# EAGLE design expansion_module_BLE_BMD330AR (EAGLE 9.6.2)
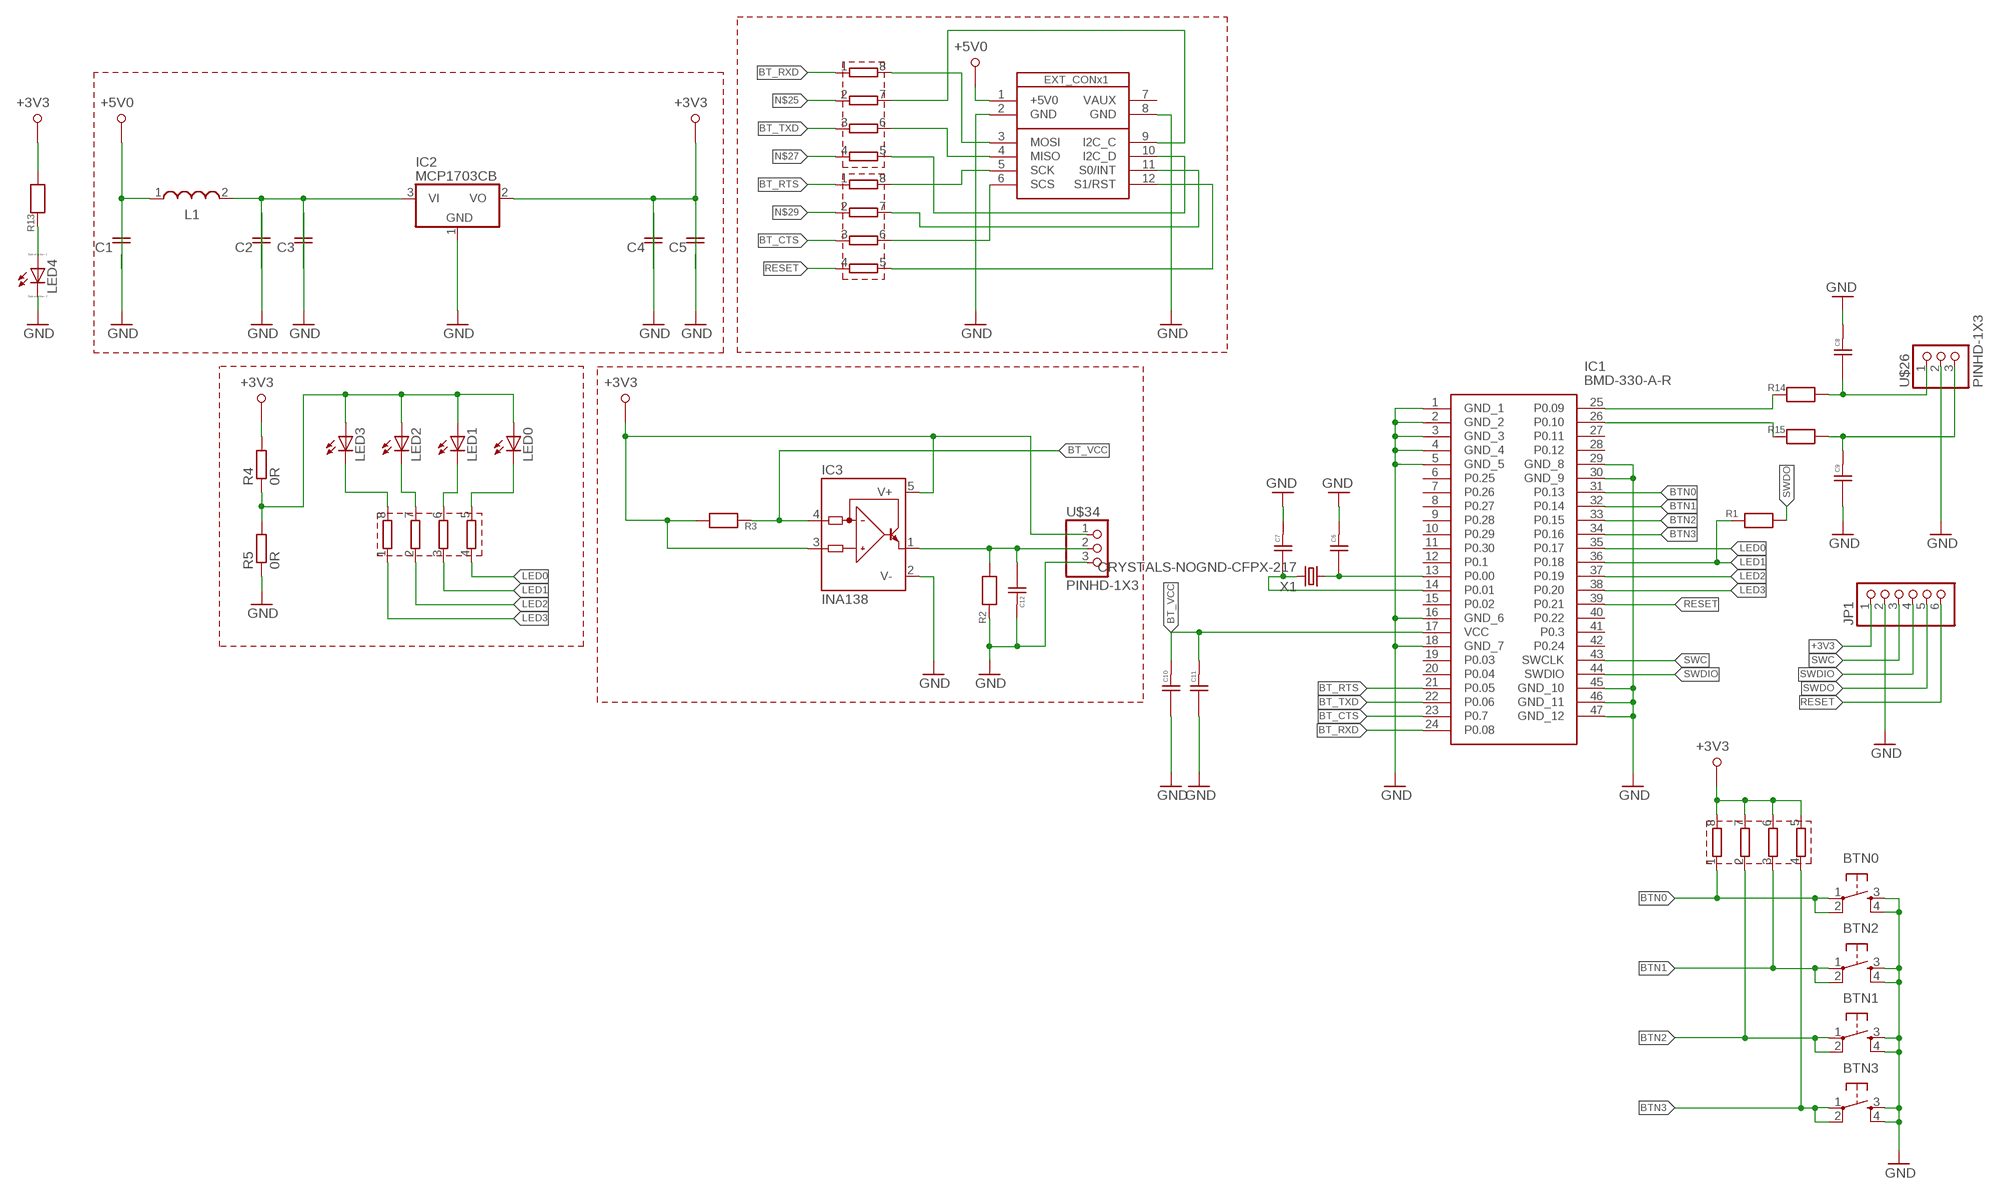
[diagram p0: schematic, sheet 1]

## Parts
BTN0  TACT-SWITCH-SMD_KMR2  [KMR2]
BTN1  TACT-SWITCH-SMD_KMR2  [KMR2]
BTN2  TACT-SWITCH-SMD_KMR2  [KMR2]
BTN3  TACT-SWITCH-SMD_KMR2  [KMR2]
C1  CAPACITOR_CERAMIC_0402  [CAPACITOR_0402]
C2  CAPACITOR_CERAMIC_0402  [CAPACITOR_0402]
C3  CAPACITOR_CERAMIC_0402  [CAPACITOR_0402]
C4  CAPACITOR_CERAMIC_0402  [CAPACITOR_0402]
C5  CAPACITOR_CERAMIC_0402  [CAPACITOR_0402]
C6  CAPACITOR_CERAMIC_0402  [CAPACITOR_0402]
C7  CAPACITOR_CERAMIC_0402  [CAPACITOR_0402]
C8  CAPACITOR_CERAMIC_0402  [CAPACITOR_0402]
C9  CAPACITOR_CERAMIC_0402  [CAPACITOR_0402]
C10  CAPACITOR_CERAMIC_0402  [CAPACITOR_0402]
C11  CAPACITOR_CERAMIC_0402  [CAPACITOR_0402]
C12  CAPACITOR_CERAMIC_0402  [CAPACITOR_0402]
IC1  BMD-330-A-R  [BMD-300]
IC2  MCP1703CB  [SOT23]
IC3  INA138  [SOT23-5]
JP1  PINHD-1X6  [1X06]
L1  WE-LQ_1210  [WE-LQ_M]
LED0  LEDSML0603  [SML0603]
LED1  LEDSML0603  [SML0603]
LED2  LEDSML0603  [SML0603]
LED3  LEDSML0603  [SML0603]
LED4  LED_ESML0603  [LED_SML0603]
R1  RESISTOR_0402  [RESISITOR_0402]
R2  RESISTOR_0402  [RESISITOR_0402]
R3  RESISTOR_0402  [RESISITOR_0402]
R4  0R  R-EU_R0603  [R0603]
R5  0R  R-EU_R0603  [R0603]
R13  RESISTOR_0402  [RESISITOR_0402]
R14  RESISTOR_0402  [RESISITOR_0402]
R15  RESISTOR_0402  [RESISITOR_0402]
RN1  RESISTOR-DIL_4R-N  [EXB28V]
RN2  RESISTOR-DIL_4R-N  [EXB28V]
RN3  RESISTOR-DIL_4R-N  [EXB28V]
RN4  RESISTOR-DIL_4R-N  [EXB28V]
U$1  SB_EXT_CON_X1_SPI  [SB_EXT_CON_X1_FULL]
U$26  PINHD-1X3  [1X03]
U$34  PINHD-1X3  [1X03]
X1  CRYSTALS-NOGND-CFPX-217  [3.2X1.5-2-PAD]

## Nets
+3V3: C4.2 C5.2 IC2.2(VO) IC3.3(IN+) IC3.5(V+) JP1.1 R3.2 R4.2 R13.2 RN4.5 RN4.6 RN4.7 RN4.8 U$34.1
+5V0: C1.2 L1.1 U$1.1(+5V0)
BT_CTS: IC1.23(P0.7) RN1.3
BT_RTS: IC1.21(P0.05) RN1.1
BT_RXD: IC1.24(P0.08) RN2.1
BT_TXD: IC1.22(P0.06) RN2.3
BT_VCC: C10.2 C11.2 IC1.17(VCC) IC3.4(IN-) R3.1
BTN0: BTN0.1 BTN0.2 IC1.31(P0.13) RN4.1
BTN1: BTN2.1 BTN2.2 IC1.32(P0.14) RN4.3
BTN2: BTN1.1 BTN1.2 IC1.33(P0.15) RN4.2
BTN3: BTN3.1 BTN3.2 IC1.34(P0.16) RN4.4
GND: BTN0.3 BTN0.4 BTN1.3 BTN1.4 BTN2.3 BTN2.4 BTN3.3 BTN3.4 C1.1 C2.1 C3.1 C4.1 C5.1 C6.2 C7.2 C8.2 C9.1 C10.1 C11.1 C12.2 IC1.1(GND_1) IC1.2(GND_2) IC1.3(GND_3) IC1.4(GND_4) IC1.5(GND_5) IC1.16(GND_6) IC1.18(GND_7) IC1.29(GND_8) IC1.30(GND_9) IC1.45(GND_10) IC1.46(GND_11) IC1.47(GND_12) IC2.1(GND) IC3.2(V-) JP1.2 LED4.C R2.1 R5.1 U$1.2(GND) U$1.8(GND) U$26.2 U$34.3
LED0: IC1.35(P0.17) RN3.4
LED1: IC1.36(P0.18) R1.1 RN3.3
LED2: IC1.37(P0.19) RN3.2
LED3: IC1.38(P0.20) RN3.1
N$1: C2.2 C3.2 IC2.3(VI) L1.2
N$6: LED2.C RN3.7
N$7: LED1.C RN3.6
N$8: RN2.6 U$1.4(MISO)
N$9: LED0.A LED1.A LED2.A LED3.A R4.1 R5.2
N$10: LED0.C RN3.5
N$11: LED4.A R13.1
N$12: RN2.8 U$1.3(MOSI)
N$13: RN1.8 U$1.5(SCK)
N$14: RN1.6 U$1.6(SCS)
N$15: RN2.7 U$1.9(I2C_C)
N$16: C12.1 IC3.1(OUT) R2.2 U$34.2
N$17: IC1.25(P0.09) R14.1
N$18: IC1.26(P0.10) R15.1
N$19: C9.2 R15.2 U$26.3
N$20: C8.1 R14.2 U$26.1
N$21: RN2.5 U$1.10(I2C_D)
N$22: RN1.7 U$1.11(S0/INT)
N$23: RN1.5 U$1.12(S1/RST)
N$24: LED3.C RN3.8
N$25: RN2.2
N$26: C6.1 IC1.13(P0.00) X1.1
N$27: RN2.4
N$28: C7.1 IC1.14(P0.01) X1.2
N$29: RN1.2
RESET: IC1.39(P0.21) JP1.6 RN1.4
SWC: IC1.43(SWCLK) JP1.3
SWDIO: IC1.44(SWDIO) JP1.4
SWDO: JP1.5 R1.2
Unconnected: IC1.6(P0.25) IC1.7(P0.26) IC1.8(P0.27) IC1.9(P0.28) IC1.10(P0.29) IC1.11(P0.30) IC1.12(P0.1) IC1.15(P0.02) IC1.19(P0.03) IC1.20(P0.04) IC1.27(P0.11) IC1.28(P0.12) IC1.40(P0.22) IC1.41(P0.3) IC1.42(P0.24) U$1.7(VAUX)

## Library data of the parts
BTN0 BTN1-BTN3 = FaBo-Switch:TACT-SWITCH: Part No Maker Datasheet Distributor 1273HA-160G-G SWITRONIC Catalog <http://www.switronic.com/uploads/images/A10.gif> Akizuki <http://akizukidenshi.com/catalog/g/gP-02561/> DTS-6-V Cosland DTS 6 Series <http://www.cosland.com/newproduct/DTS%20SERIES.pdf> Akizuki <http://akizukidenshi.com/catalog/g/gP-03647/> KMR2 C&K KMR2 SERIES <https://www.ckswitches.com/products/switches/product-details/Tactile/KMR2/> Octoparts Result <https://octopart.com/search?q=KMR2&start=0> TSHA-T-XB2-19E TOP UP INDUSTORY TSHA-T <http://www.top-up.com.tw/front/bin/ptdetail.phtml?Part=TSHA-T> Akizuki <http://akizukidenshi.com/catalog/g/gP-09361/>
C1-C12 = vb_RLCD:CAPACITOR_CERAMIC_0402
IC1 = BMD-330-A-R:BMD-330-A-R: Bluetooth Modules (802.15.1) BMD-330-A-R Source: Datasheet <https://rigado.sharepoint.com/sites/Public/Shared Documents/Forms/AllItems.aspx?id=/sites/Public/Shared Documents/Website/Modules/BMD-300/BMD-330-Data-Sheet-v2.0.pdf&parent=/sites/Public/Shared Documents/Website/Modules%2>; DESCRIPTION: Bluetooth Modules (802.15.1) BMD-330-A-R; HEIGHT: mm; MANUFACTURER_NAME: Rigado; MANUFACTURER_PART_NUMBER: BMD-330-A-R; MOUSER_PART_NUMBER: 377-BMD-330-A-R; MOUSER_PRICE-STOCK: https://www.mouser.com/Search/Refine.aspx?Keyword=377-BMD-330-A-R
IC2 = linear:MCP1703: 250 mA, 16V, Low Quiescent Current LDO Regulator Source: http://ww1.microchip.com/downloads/en/DeviceDoc/22049b.pdf
IC3 = burr-brown:INA138: High-Side Measurement Current Shunt Monitor; MF: TEXAS INSTRUMENTS; MPN: INA138NA/250; OC_FARNELL: 1564888; OC_NEWARK: 80K5906
JP1 = vb_pinhead:PINHD-1X6: PIN HEADER
L1 = EagleLibrary_Wuerth_Elektronik_eiSos_rev16a:WE-LQ: SMD Inductor Characteristics Miniature chip inductor wound on a special ferrite core Small inductances for compact circuits High Q at high frequencies Low DC-resistance Operating temperature: –40 ºC to +125 ºC Applications Low power DC/DC-converters from Linear Technology, National Semiconductor, Texas Instruments, Fairchild Semiconductor, ON Semiconductor, STMicroelectronics, Maxim, MPS, Semtech, Exar, Analogic Tech, Diodes and Cologne Chip EMI-Filtering RF-circuits <http://katalog.we-online.de/media/images/eisos/IndLQ_pf2.jpg> Details see: http://katalog.we-online.de/en/pbs/WE-LQ? Updated by Dan Xu 2014-07-08 2014 (C) Wurth Elektronik
LED0 LED1-LED3 = led:LED: LED OSRAM: - CHIPLED LG R971, LG N971, LY N971, LG Q971, LY Q971, LO R971, LY R971 LH N974, LH R974 LS Q976, LO Q976, LY Q976 LO Q996 - Hyper CHIPLED LW Q18S LB Q993, LB Q99A, LB R99A - SideLED LS A670, LO A670, LY A670, LG A670, LP A670 LB A673, LV A673, LT A673, LW A673 LH A674 LY A675 LS A676, LA A676, LO A676, LY A676, LW A676 LS A679, LY A679, LG A679 - Hyper Micro SIDELED® LS Y876, LA Y876, LO Y876, LY Y876 LT Y87S - SmartLED LW L88C, LW L88S LB L89C, LB L89S, LG L890 LS L89K, LO L89K, LY L89K LS L896, LA L896, LO L896, LY L896 - TOPLED LS T670, LO T670, LY T670, LG T670, LP T670 LSG T670, LSP T670, LSY T670, LOP T670, LYG T670 LG T671, LOG T671, LSG T671 LB T673, LV T673, LT T673, LW T673 LH T674 LS T676, LA T676, LO T676, LY T676, LB T676, LH T676, LSB T676, LW T676 LB T67C, LV T67C, LT T67C, LS T67K, LO T67K, LY T67K, LW E67C LS E67B, LA E67B, LO E67B, LY E67B, LB E67C, LV E67C, LT E67C LW T67C LS T679, LY T679, LG T679 LS T770, LO T770, LY T770, LG T770, LP T770 LB T773, LV T773, LT T773, LW T773 LH T774 LS E675, LA E675, LY E675, LS T675 LS T776, LA T776, LO T776, LY T776, LB T776 LHGB T686 LT T68C, LB T68C - Hyper Mini TOPLED® LB M676 - Mini TOPLED Santana® LG M470 LS M47K, LO M47K, LY M47K Source: http://www.osram.convergy.de LUXEON: - LUMILED® LXK2-PW12-R00, LXK2-PW12-S00, LXK2-PW14-U00, LXK2-PW14-V00 LXK2-PM12-R00, LXK2-PM12-S00, LXK2-PM14-U00 LXK2-PE12-Q00, LXK2-PE12-R00, LXK2-PE12-S00, LXK2-PE14-T00, LXK2-PE14-U00 LXK2-PB12-K00, LXK2-PB12-L00, LXK2-PB12-M00, LXK2-PB14-N00, LXK2-PB14-P00, LXK2-PB14-Q00 LXK2-PR12-L00, LXK2-PR12-M00, LXK2-PR14-Q00, LXK2-PR14-R00 LXK2-PD12-Q00, LXK2-PD12-R00, LXK2-PD12-S00 LXK2-PH12-R00, LXK2-PH12-S00 LXK2-PL12-P00, LXK2-PL12-Q00, LXK2-PL12-R00 Source: www.luxeon.com KINGBRIGHT: KA-3528ASYC Source: www.kingbright.com
LED4 = eagle-ltspice:LED_E: LED Source: http://www.osram.convergy.de Source: www.luxeon.com Source: www.kingbright.com; SPICEMODEL: NONE; SPICEPREFIX: D; SPICETYPE: diode
R1-R3 R14 R15 = vb_RLCD:RESISTOR_0402: 301010006
R4 R5 = rcl:R-EU_: RESISTOR, European symbol; SPICEPREFIX: R
R13 = vb_RLC:RESISTOR_0402: 301010006
RN1-RN4 = vb_res_array:RESISTOR-DIL_4R-N: Array Chip Resistor Source: Panasonic
U$1 = al_smartboard:SB_EXT_CON_X1_SPI
U$26 U$34 = vb_pinhead:PINHD-1X3
X1 = IQD-Frequency-Products:CRYSTALS-NOGND: CRYSTALS CAN NOT GROUNDED

## Board
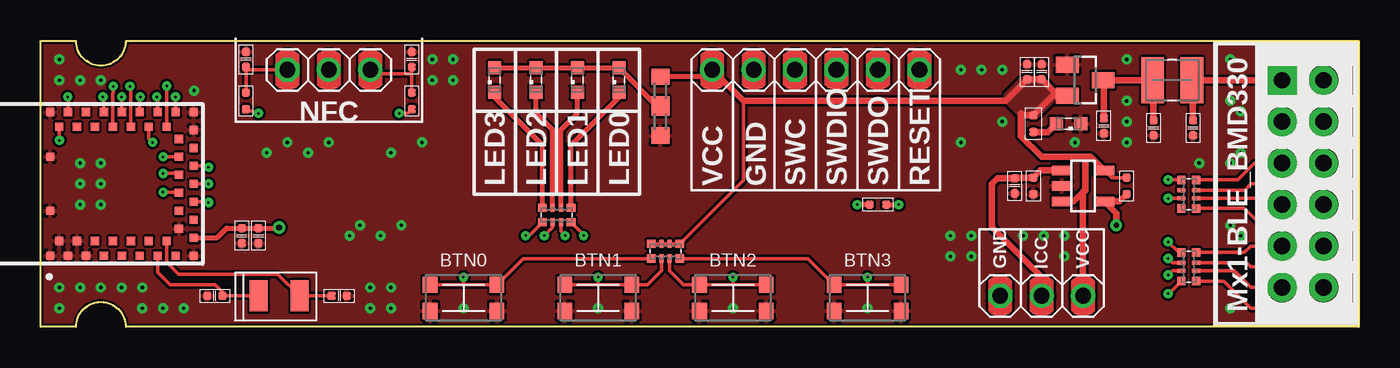
[diagram p1: board, top side]
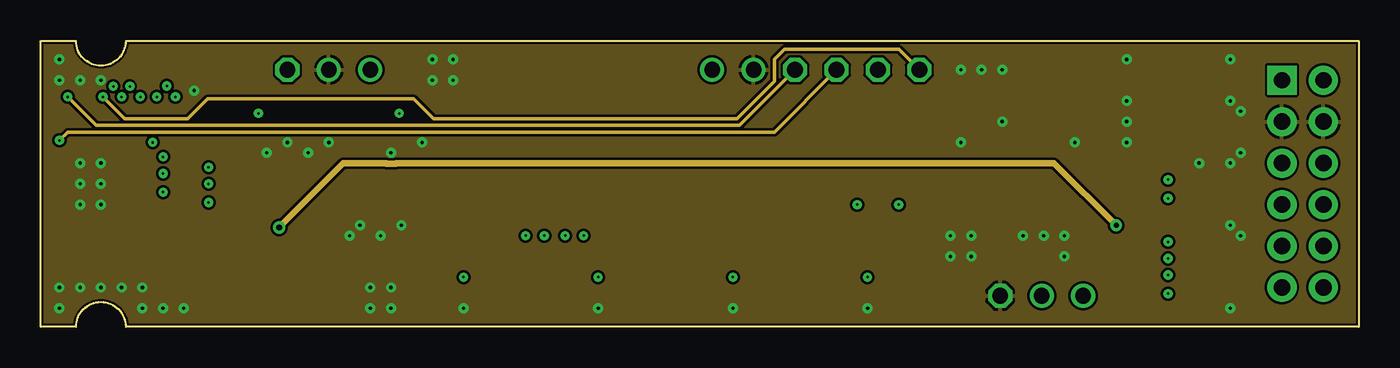
[diagram p2: board, inner layer Route2]
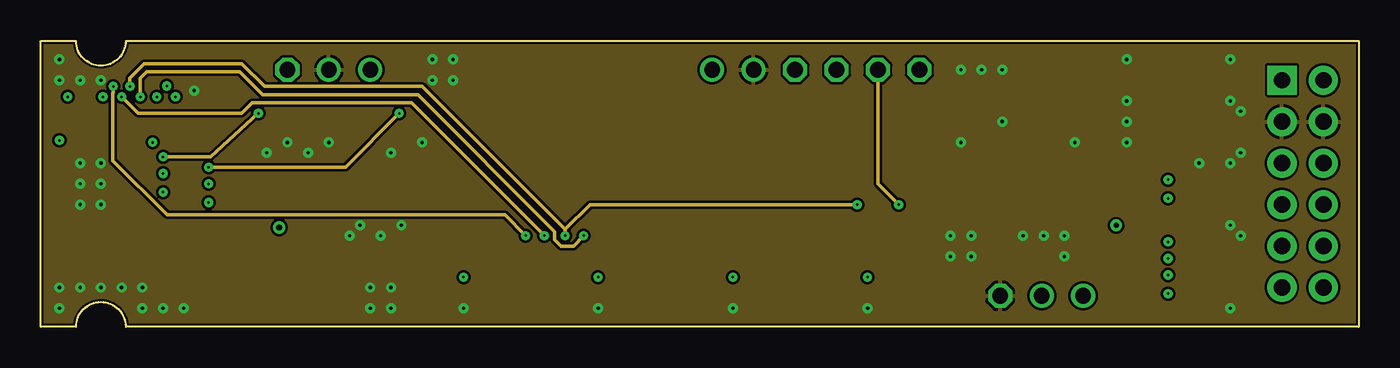
[diagram p3: board, inner layer Route15]
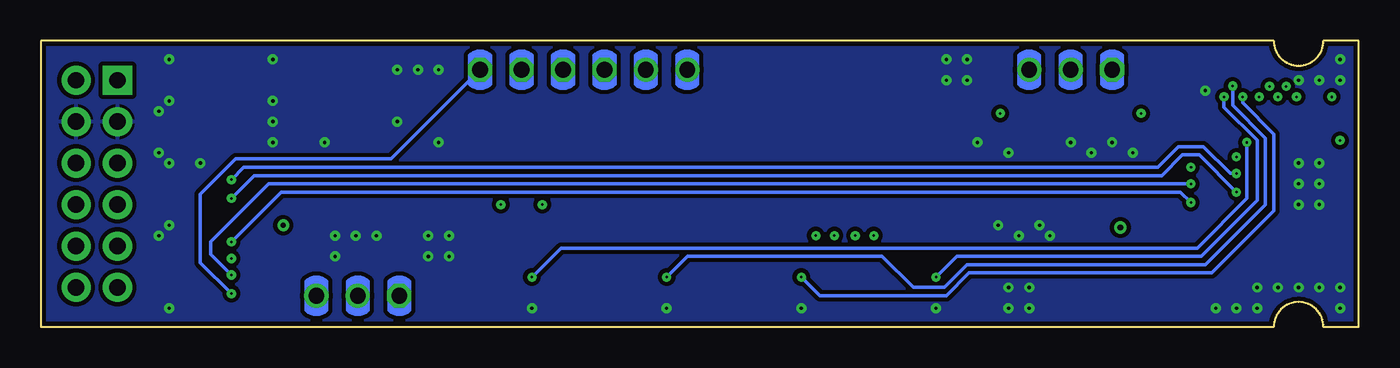
[diagram p4: board, bottom side, seen from below]

Size 80.77 x 17.53 mm. Coordinates in mm from the lower left corner, seen from the top.
Copper layers (1*2*15*16): Top 0.035mm / dielectric 1.5mm / Route2 0.035mm / dielectric 0.15mm / Route15 0.035mm / dielectric 0.2mm / Bottom 0.035mm
Design rules "default *": minimum track width 6mil, minimum drill 0.15mm, track to track 6mil, track to pad 6mil, pad to pad 6mil, via to via 6mil, smd to smd 0mil, copper to edge 5mil, drill to drill 6mil, minimum pad ring 10mil, minimum via ring 8mil, stop-mask expansion 1mil, vias tented up to drill 20mil, thermal gap 7mil

### Footprints (pad centres in the part's own frame; a part is rotated, then mirrored left to right if it is on the bottom)
KMR2 = smd 0.9 x 1: 1 -2.05,0.8; 2 2.05,0.8; 3 2.05,-0.8; 4 -2.05,-0.8
CAPACITOR_0402 = smd 0.5 x 0.5: 1 -0.463,0; 2 0.463,0
BMD-300 = smd 0.5 x 0.5: 1 -2.35,-4.4; 2 -1.8,-3.5; 3 -1.25,-4.4; 4 -0.7,-3.5; 5 -0.15,-4.4; 6 0.4,-3.5; 7 0.95,-4.4; 8 1.5,-3.5; 9 2.05,-4.4; 10 2.6,-3.5; 11 3.15,-4.4; 12 3.7,-3.5; 13 4.25,-4.4; 14 4.8,-3.5; 15 5.35,-4.4; 16 6.45,-4.4; 17 6.45,-3.3; 18 5.55,-2.75; 19 6.45,-2.2; 20 5.55,-1.65; 21 6.45,-1.1; 22 5.55,-0.55; 23 6.45,0; 24 5.55,0.55; 25 6.45,1.1; 26 5.55,1.65; 27 6.45,2.2; 28 5.55,2.75; 29 6.45,3.3; 30 6.45,4.4; 31 5.35,4.4; 32 4.8,3.5; 33 4.25,4.4; 34 3.7,3.5; 35 3.15,4.4; 36 2.6,3.5; 37 2.05,4.4; 38 1.5,3.5; 39 0.95,4.4; 40 0.4,3.5; 41 -0.15,4.4; 42 -0.7,3.5; 43 -1.25,4.4; 44 -1.8,3.5; 45 -2.35,4.4; 46 -2.35,1.65; 47 -2.35,-1.65
SOT23 = smd 1 x 1.4: 1 -0.95,-1.1; 2 0.95,-1.1; 3 0,1.1
SOT23-5 = smd 0.6 x 1.2: 1 -0.95,-1.306; 2 0,-1.306; 3 0.95,-1.306; 4 0.95,1.306; 5 -0.95,1.306
1X06 = drill 0.965 pad 1.422: 1 -3.81,0; 2 -1.27,0 | drill 0.965 pad 1.422 octagon: 3 1.27,0; 4 3.81,0; 5 6.35,0; 6 8.89,0
WE-LQ_M = smd 1.4 x 2.8: 1 -1.2,0; 2 1.2,0
SML0603 = smd 0.8 x 0.8: A 0.75,0; C -0.75,0
LED_SML0603 = smd 0.8 x 0.8: A 0.75,0; C -0.75,0
RESISITOR_0402 = smd 0.5 x 0.5: 1 -0.508,0; 2 0.508,0
R0603 = smd 1 x 1.1: 1 -0.85,0; 2 0.85,0
RESISITOR_0402' = smd 0.5 x 0.5: 1 0.508,0; 2 -0.508,0
EXB28V = smd 0.525 x 0.5: 1 -0.875,-0.45; 4 0.875,-0.45; 5 0.875,0.45; 8 -0.875,0.45 | smd 0.25 x 0.5: 2 -0.25,-0.45; 3 0.25,-0.45; 6 0.25,0.45; 7 -0.25,0.45
SB_EXT_CON_X1_FULL = drill 1 pad 1.778 square: 1 15.24,5.08 | drill 1 pad 1.778: 2 12.7,5.08; 3 10.16,5.08; 4 7.62,5.08; 5 5.08,5.08; 6 2.54,5.08; 7 15.24,2.54; 8 12.7,2.54; 9 10.16,2.54; 10 7.62,2.54; 11 5.08,2.54; 12 2.54,2.54
1X03 = drill 0.965 pad 1.422: 1 -3.81,0; 2 -1.27,0 | drill 0.965 pad 1.422 octagon: 3 1.27,0
3.2X1.5-2-PAD = smd 1.1 x 1.9: 1 -1.25,0; 2 1.25,0

### Placement (x,y rotation side)
BTN0  25.91,1.78 0 top
BTN1  34.16,1.78 0 top
BTN2  42.42,1.78 0 top
BTN3  50.67,1.78 0 top
C1  70.61,12.19 90 top
C2  68.2,12.19 90 top
C3  65.15,12.32 90 top
C4  61.34,15.62 270 top
C5  60.45,15.62 270 top
C6  10.67,1.9 180 top
C7  18.29,1.9 0 top
C8  22.73,16.38 90 top
C9  12.57,16.38 270 top
C10  12.32,5.59 90 top
C11  13.34,5.59 90 top
C12  59.69,8.64 270 top
IC1  2.92,8.76 0 top
IC2  64.01,15.11 270 top
IC3  63.88,8.64 270 top
JP1  44.96,15.75 0 top
L1  69.34,15.11 180 top
LED0  35.43,15.11 90 top
LED1  32.89,15.11 90 top
LED2  30.35,15.11 90 top
LED3  27.81,15.11 90 top
LED4  62.99,12.45 180 top
R1  51.31,7.49 0 top
R2  60.83,8.64 90 top
R3  66.55,8.64 90 top
R4  37.97,14.48 90 top
R5  37.97,12.57 90 top
R13  [RESISITOR_0402']  60.83,12.45 270 top
R14  22.73,13.84 90 top
R15  12.57,13.84 90 top
RN1  70.36,3.68 270 top
RN2  70.36,8.13 270 top
RN3  31.62,6.86 0 top
RN4  38.29,4.64 0 top
U$1  81.15,-0.13 90 top
U$26  16.38,15.75 180 top
U$34  60.07,1.9 180 top
X1  14.61,1.9 0 top

### Tracks (layer width: path | path; a pad name or v marks a point on that pad's centre or on a via)
+3V3
  Top 0.203: RN4.8 RN4.7 RN4.6 RN4.5 43.05,8.97 43.05,13.84 | R3.2 65.63,9.14 65.2,9.57 IC3.5
  Top 0.305: JP1.1 40.73,15.33 R4.2
  Top 0.406: 62.34,14.16 C4.2 C5.2 59.14,13.84 43.05,13.84 JP1.1 | 62.34,14.16 IC2.2 | 62.34,14.16 62.04,14.16 R13.2 60.2,12.95 60.07,13.08 60.07,11.68 61.34,10.41 63.88,10.41 | 65.2,9.57 64.36,10.41 63.88,10.41 | IC3.3 63.31,7.69 63.88,8.25 | 63.88,10.41 64.01,10.29 64.01,8.38 63.88,8.25 | U$34.1 63.88,8.25
  pour Top (no thermals): 61.34,15.24 62.1,14.48 62.1,13.97 61.09,12.95 60.83,12.95 60.07,12.95 59.18,13.84 59.18,14.22 60.2,15.24
+5V0
  Top 0.406: U$1.1 70.74,15.11 | 70.74,15.11 L1.1 | C1.2 70.61,14.99 70.74,15.11
BT_CTS  (via drill 0.15)
  Top 0.203: IC1.23 v10.29,8.76 | RN1.3 69.35,3.43 v69.09,3.17
  Bottom 0.203: v10.29,8.76 66.8,8.76 70.36,5.21 70.36,4.44 v69.09,3.17
BT_RTS  (via drill 0.15)
  Top 0.203: IC1.21 10.24,7.66 v10.29,7.62 | RN1.1 69.74,4.56 v69.09,5.21
  Bottom 0.203: v10.29,7.62 10.92,8.25 66.04,8.25 v69.09,5.21
BT_RXD  (via drill 0.15)
  Top 0.203: v7.49,9.4 8.39,9.4 IC1.24 | v69.09,9.02 v69.1,9 RN2.1
  Bottom 0.203: v7.49,9.4 7.87,9.4 9.53,11.05 11.05,11.05 12.32,9.78 68.33,9.78 v69.09,9.02
BT_TXD  (via drill 0.15)
  Top 0.203: v7.49,8.25 8.43,8.25 IC1.22 | v69.09,7.87 RN2.3
  Bottom 0.203: v7.49,8.25 9.78,10.54 10.8,10.54 12.07,9.27 67.69,9.27 v69.09,7.87
BT_VCC  (via drill 0.3, 0.35)
  Top 0.305: IC1.17 10.8,5.46 11.39,6.05 C10.2 C11.2 14.56,6.05 v14.61,6.1
  Top 0.406: R3.1 66.11,7.69 IC3.4 65.91,6.96 v65.91,6.22
  Route2 0.406: v65.91,6.22 62.1,10.03 21.76,10.03 21.74,10.01 21.19,10.01 21.16,10.03 18.54,10.03 v14.61,6.1
BTN0  (via drill 0.15)
  Top 0.203: RN4.1 29.57,4.19 BTN0.2 25.91,2.58 | BTN0.1 25.91,2.58 | 25.91,2.58 v25.91,3.05 | IC1.31 8.27,14.08 v8.26,14.1
  Bottom 0.203: v8.26,14.1 8.26,13.45 6.22,11.42 6.22,7.75 9.65,4.32 24.64,4.32 v25.91,3.05
BTN1  (via drill 0.15)
  Top 0.203: RN4.3 38.54,3.43 39.4,2.58 BTN2.1 42.42,2.58 | 42.42,2.58 BTN2.2 | 42.42,2.58 v42.42,3.05 | IC1.32 v7.72,14.76
  Bottom 0.203: v7.72,14.76 7.72,13.56 5.72,11.56 5.72,7.49 9.4,3.81 24,3.81 25.4,2.41 27.31,2.41 29.21,4.32 41.15,4.32 v42.42,3.05
BTN2  (via drill 0.15)
  Top 0.203: RN4.2 38.04,3.43 37.19,2.58 BTN1.2 34.16,2.58 | BTN1.1 34.16,2.58 | 34.16,2.58 v34.16,3.05 | IC1.33 7.17,14.04 v7.11,14.1
  Bottom 0.203: v7.11,14.1 7.11,13.72 5.21,11.81 5.21,7.11 9.02,3.3 23.88,3.3 25.27,1.9 33.02,1.9 v34.16,3.05
BTN3  (via drill 0.15)
  Top 0.203: RN4.4 47.02,4.19 BTN3.1 50.67,2.58 | 50.67,2.58 BTN3.2 | 50.67,2.58 v50.67,3.05 | IC1.34 6.62,11.54 v6.86,11.3
  Bottom 0.203: v6.86,11.3 6.86,7.87 9.91,4.83 48.9,4.83 v50.67,3.05
GND  (via drill 0.2)
  other vias: 62.74,4.32 61.47,5.59 62.74,5.59 60.2,5.59 72.9,6.22 73.53,5.59 72.9,10.03 73.53,10.67 72.9,1.14 72.9,13.84 73.53,13.21 72.9,16.38 66.55,16.38 66.55,13.84 66.55,12.57 66.55,11.3 70.99,10.03 63.37,11.3 58.93,12.57 58.93,15.75 57.66,15.75 56.39,15.75 56.39,11.3 57.02,4.32 57.02,5.59 55.75,5.59 55.75,4.32 50.67,1.14 42.42,1.14 34.16,1.14 25.91,1.14 21.46,1.14 20.19,1.14 20.19,2.41 21.46,2.41 8.76,1.14 7.49,1.14 6.22,1.14 6.22,2.41 4.95,2.41 3.68,2.41 2.41,2.41 1.14,2.41 1.14,1.14 2.41,10.03 2.41,8.76 2.41,7.49 3.68,7.49 3.68,8.76 3.68,10.03 1.14,16.38 1.14,15.11 2.41,15.11 3.68,15.11 9.4,14.48 13.84,10.67 15.11,11.3 16.38,10.67 17.65,11.3 21.46,10.67 23.37,11.3 25.27,16.38 24,16.38 24,15.11 25.27,15.11 22.1,6.22 20.83,5.59 19.56,6.22 18.92,5.59
  pour Bottom (isolate 0.254): -2.03,17.65 81.15,17.65 81.15,-0.13 -2.03,-0.13
  pour Top (rank 6): -1.52,17.52 81.15,17.65 81.15,-0.13 -1.52,-0.26
  pour Route2: -1.4,18.92 82.42,18.92 82.42,-1.4 -1.4,-1.4
  pour Route15: -1.4,18.92 82.42,18.92 82.42,-1.4 -1.4,-1.4
LED0  (via drill 0.15)
  Top 0.203: RN3.4 33.27,5.63 v33.27,5.59 | IC1.35 6.07,14.07 v6.1,14.1
  Route15 0.203: v6.1,14.1 6.1,15.24 6.48,15.62 12.19,15.62 13.59,14.22 23.11,14.22 31.5,5.84 31.5,5.33 31.88,4.95 32.64,4.95 v33.27,5.59
LED1  (via drill 0.15)
  Top 0.203: RN3.3 31.87,5.85 v32.13,5.59 | IC1.36 5.52,14.67 v5.46,14.73
  Top 0.305: R1.1 v50.04,7.49
  Route15 0.203: v50.04,7.49 33.66,7.49 32.13,5.97 | 32.13,5.97 v32.13,5.59 | 32.13,5.97 23.37,14.73 13.72,14.73 12.32,16.13 6.35,16.13 5.46,15.24 v5.46,14.73
LED2  (via drill 0.15)
  Top 0.203: RN3.2 31.37,6.1 v30.86,5.59 | IC1.37 4.97,14.08 v4.95,14.1
  Route15 0.203: v30.86,5.59 22.73,13.72 12.95,13.72 12.32,13.08 5.97,13.08 v4.95,14.1
LED3  (via drill 0.15)
  Top 0.203: RN3.1 29.93,5.59 v29.72,5.59 | IC1.38 4.42,13.88 4.42,14.32 4.45,14.34 v4.45,14.73
  Route15 0.203: v4.45,14.73 4.45,14.34 4.42,14.32 4.42,10.18 7.75,6.86 28.45,6.86 v29.72,5.59
N$1
  Top 0.406: C2.2 68.2,15.06 L1.2 IC2.3 65.15,15.07 C3.2
N$6
  Top 0.305: RN3.7 31.37,12.07 30.35,13.09 LED2.C
N$7
  Top 0.305: RN3.6 31.87,12.07 32.89,13.09 LED1.C
N$8
  Top 0.203: RN2.6 75.69,7.88 U$1.4
N$9
  Top 0.152: 37.87,13.42 R5.2 R4.1
  Top 0.305: LED3.A LED2.A LED1.A LED0.A 37.87,13.42
N$10
  Top 0.305: RN3.5 32.5,11.12 35.43,14.05 LED0.C
N$11
  Top 0.406: R13.1 61.73,11.94 LED4.A
N$12
  Top 0.203: U$1.3 74.38,10.03 73.35,9 RN2.8
N$13
  Top 0.203: RN1.8 73.77,4.56 74.17,4.95 U$1.5
N$14
  Top 0.203: RN1.6 73.15,3.43 74.17,2.41 U$1.6
N$15
  Top 0.203: RN2.7 73.78,8.38 74.17,8.76 77.34,8.76 U$1.9
N$16
  Top 0.406: IC3.1 61.28,9.59 R2.2 59.73,9.14 C12.1 58.63,9.1 58.29,8.76 58.29,6.1 61.34,3.05 U$34.2
N$17  (via drill 0.15)
  Top 0.203: v10.29,9.78 10.2,9.86 IC1.25 | R14.1 22.48,13.08 v21.97,13.08
  Route15 0.203: v10.29,9.78 18.67,9.78 v21.97,13.08
N$18  (via drill 0.15)
  Top 0.203: v7.49,10.41 IC1.26 | R15.1 v13.34,13.08
  Route15 0.203: v7.49,10.41 10.41,10.41 v13.34,13.08
N$19
  Top 0.203: R15.2 C9.2 12.75,15.75 U$26.3
N$20
  Top 0.203: C8.1 22.73,15.49 | 22.73,15.49 R14.2 | U$26.1 20.45,15.49 22.73,15.49
N$21
  Top 0.203: RN2.5 73.77,7.25 74.8,6.22 77.34,6.22 U$1.10
N$22
  Top 0.203: RN1.7 73.92,3.93 74.17,3.68 77.34,3.68 U$1.11
N$23
  Top 0.203: RN1.5 72.5,2.81 74.17,1.14 77.34,1.14 U$1.12
N$24
  Top 0.305: RN3.8 30.75,11.12 27.81,14.05 LED3.C
N$26
  Top 0.203: X1.1 C6.1 11.13,2.16 10.7,2.59 7.93,2.59 7.17,3.35 IC1.13
N$28
  Top 0.203: C7.1 X1.2 14.52,3.24 8.45,3.24 7.72,3.96 IC1.14
N$29  (via drill 0.15)
  Top 0.203: RN1.2 69.35,3.93 v69.09,4.19
RESET  (via drill 0.15)
  Top 0.203: v3.81,14.1 3.87,14.04 IC1.39 | RN1.4 69.13,2.03 v69.09,2.03
  Route2 0.203: v3.81,14.1 5.15,12.75 9.02,12.75 10.23,13.97 22.86,13.97 24.08,12.75 42.66,12.75 44.96,15.05 44.96,16.38 45.59,17.02 52.58,17.02 JP1.6
  Bottom 0.203: v69.09,2.03 70.99,3.94 70.99,8.13 68.83,10.29 59.31,10.29 JP1.6
SWC  (via drill 0.15)
  Top 0.203: v1.65,14.1 1.67,14.08 IC1.43
  Route2 0.203: v1.65,14.1 3.4,12.35 42.83,12.35 JP1.3
SWDIO  (via drill 0.15)
  Top 0.203: IC1.44 1.12,11.45 v1.14,11.43
  Route2 0.203: v1.14,11.43 1.65,11.94 44.96,11.94 JP1.4
SWDO  (via drill 0.15)
  Top 0.305: R1.2 v52.58,7.49
  Route15 0.203: v52.58,7.49 51.31,8.76 JP1.5

### Text on the board
tNames: NFC | LED3 | LED2 | LED1 | LED0 | VCC | GND | SWC | SWDIO | SWDO | RESET | GND | ICC | VCC | Mx1-BLE_BMD330